# Altium schematic sheet MCU.SchDoc
size A; DocumentNumber: 2; SheetNumber: 2; SheetTotal: 6
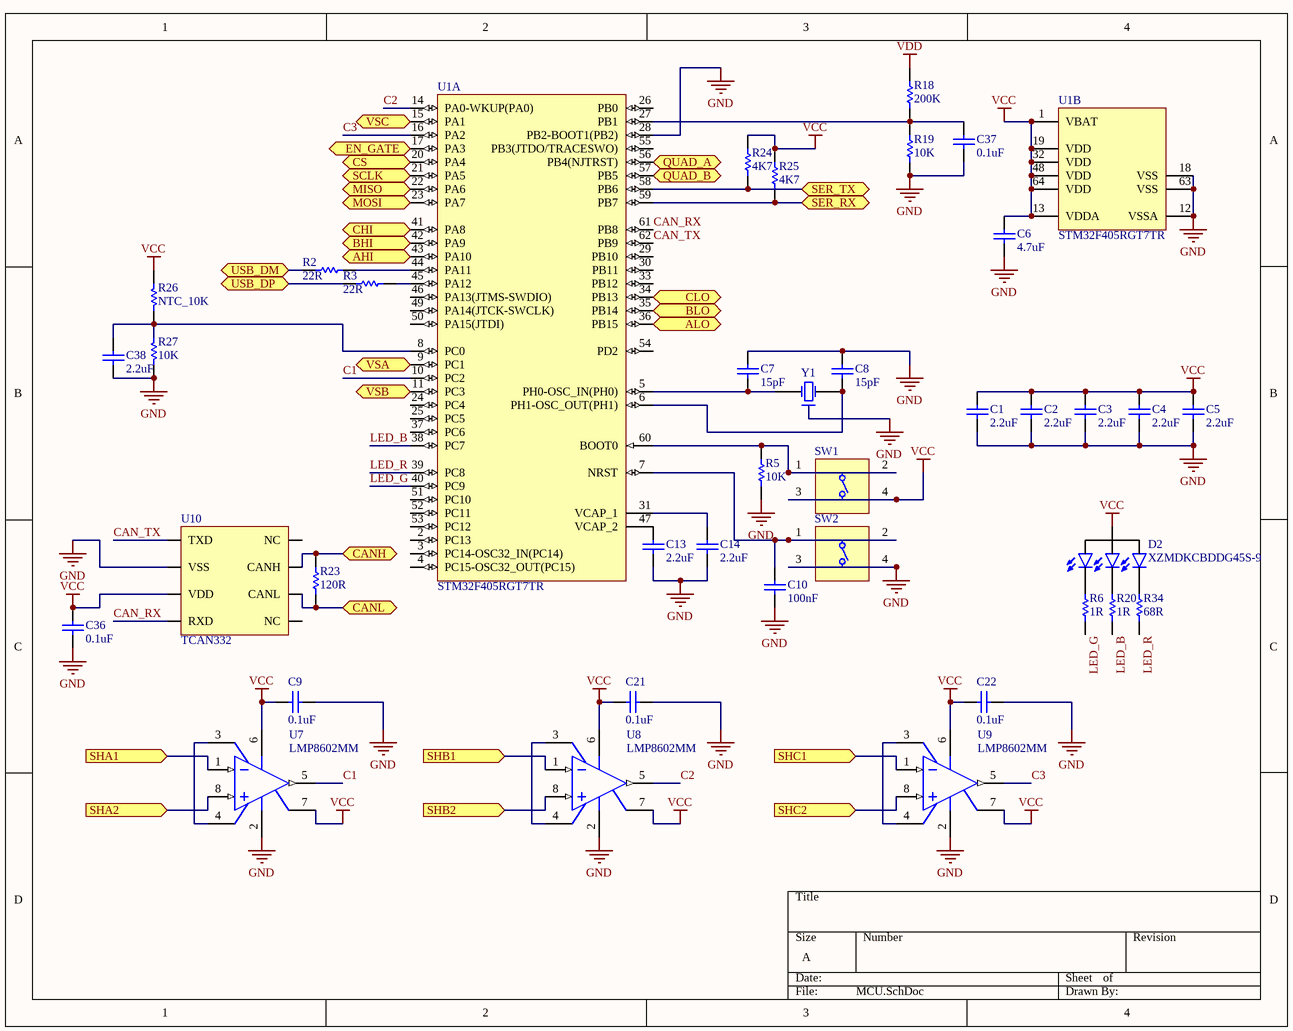
[diagram p0: MCU.SchDoc]

## Parts
C1  2.2uF  [CAPC0402(1005)60_M]
C2  2.2uF  [CAPC0402(1005)60_M]
C3  2.2uF  [CAPC0402(1005)60_M]
C4  2.2uF  [CAPC0402(1005)60_M]
C5  2.2uF  [CAPC0402(1005)60_M]
C6  4.7uF  [CAPC0402(1005)60_L]
C7  15pF  [CAPC0402(1005)60_M]
C8  15pF  [CAPC0402(1005)60_M]
C9  0.1uF  [CAPC0402(1005)60_M]
C10  100nF  [CAPC0402(1005)60_L]
C13  2.2uF  [CAPC0402(1005)60_M]
C14  2.2uF  [CAPC0402(1005)60_M]
C21  0.1uF  [CAPC0402(1005)60_M]
C22  0.1uF  [CAPC0402(1005)60_M]
C36  0.1uF  [CAPC0402(1005)60_M]
C37  0.1uF  [CAPC0402(1005)60_L]
C38  2.2uF  [CAPC0402(1005)60_M]
D2  XZMDKCBDDG45S-9  [XZMDKCBDDG45S-9]
R2  22R  [RESC0402(1005)_L]
R3  22R  [RESC0402(1005)_L]
R5  10K  [RESC0402(1005)_L]
R6  1R  [RESC0402(1005)_N]
R18  200K  [RESC0402(1005)_N]
R19  10K  [RESC0402(1005)_N]
R20  1R  [RESC0402(1005)_N]
R23  120R  [RESC0402(1005)_N]
R24  4K7  [RESC0402(1005)_L]
R25  4K7  [RESC0402(1005)_L]
R26  NTC_10K  [RESC0402(1005)_L]
R27  10K  [RESC0402(1005)_L]
R34  68R  [RESC0402(1005)_N]
SW1  (no value)  [SWITCH]
SW2  (no value)  [SWITCH]
U1  STM32F405RGT7TR  [STM-LQFP64_V]  (parts A,B of 2)
U7  LMP8602MM  [MUA08A_L]
U8  LMP8602MM  [MUA08A_L]
U9  LMP8602MM  [MUA08A_L]
U10  TCAN332  [SOT65P280X145-6N]
Y1  (no value)  [ABRA-ABM3B-4_V]

## Ports
AHI (out), ALO (out), BHI (out), BLO (out), CANH (bidir), CANL (bidir), CHI (out), CLO (out), CS (out), EN_GATE (out), MISO (in), MOSI (out), QUAD_A (in), QUAD_B (in), SCLK (out), SER_RX (bidir), SER_TX (bidir), SHA1 (in), SHA2 (in), SHB1 (in), SHB2 (in), SHC1 (in), SHC2 (in), USB_DM (bidir), USB_DP (bidir), VSA (in), VSB (in), VSC (in)

## Nets
GND: C1.1 C2.1 C3.1 C4.1 C5.1 C6.1 C7.2 C8.2 C9.2 C10.1 C13.1 C14.1 C21.2 C22.2 C36.1 C37.1 C38.1 R5.1 R19.1 R27.1 SW2.3(T3) SW2.4(T3) U1.12(VSSA) U1.18(VSS) U1.28(PB2-BOOT1(PB2)) U1.63(VSS) U7.2(GND) U8.2(GND) U9.2(GND) U10.2(VSS) Y1.2
VCC: C1.2 C2.2 C3.2 C4.2 C5.2 C6.2 C9.1 C21.1 C22.1 C36.2 D2.2(A) R24.2 R25.2 R26.2 SW1.3(T3) SW1.4(T3) U1.1(VBAT) U1.13(VDDA) U1.19(VDD) U1.32(VDD) U1.48(VDD) U1.64(VDD) U7.6(VS) U7.7(OFS) U8.6(VS) U8.7(OFS) U9.6(VS) U9.7(OFS) U10.3(VDD)
VDD: R18.1
AHI: U1.43(PA10) ; port AHI
ALO: U1.36(PB15) ; port ALO
BHI: U1.42(PA9) ; port BHI
BLO: U1.35(PB14) ; port BLO
C1: U1.10(PC2) U7.5(OUT)
C2: U1.14(PA0-WKUP(PA0)) U8.5(OUT)
C3: U1.16(PA2) U9.5(OUT)
CAN_RX: U1.61(PB8) U10.4(RXD)
CAN_TX: U1.62(PB9) U10.1(TXD)
CANH: R23.2 U10.7(CANH) ; port CANH
CANL: R23.1 U10.6(CANL) ; port CANL
CHI: U1.41(PA8) ; port CHI
CLO: U1.34(PB13) ; port CLO
CS: U1.20(PA4) ; port CS
EN_GATE: U1.17(PA3) ; port EN_GATE
LED_B: R20.1 U1.38(PC7)
LED_G: R6.1 U1.40(PC9)
LED_R: R34.1 U1.39(PC8)
MISO: U1.22(PA6) ; port MISO
MOSI: U1.23(PA7) ; port MOSI
QUAD_A: U1.56(PB4(NJTRST)) ; port QUAD_A
QUAD_B: U1.57(PB5) ; port QUAD_B
SCLK: U1.21(PA5) ; port SCLK
SER_RX: R25.1 U1.59(PB7) ; port SER_RX
SER_TX: R24.1 U1.58(PB6) ; port SER_TX
SHA1: U7.1(IN-) ; port SHA1
SHA2: U7.8(IN+) ; port SHA2
SHB1: U8.1(IN-) ; port SHB1
SHB2: U8.8(IN+) ; port SHB2
SHC1: U9.1(IN-) ; port SHC1
SHC2: U9.8(IN+) ; port SHC2
USB_DM: R2.1 ; port USB_DM
USB_DP: R3.1 ; port USB_DP
VSA: U1.9(PC1) ; port VSA
VSB: U1.11(PC3) ; port VSB
VSC: U1.15(PA1) ; port VSC
NetC7_1: C7.1 U1.5(PH0-OSC_IN(PH0)) Y1.1(X1)
NetC8_1: C8.1 U1.6(PH1-OSC_OUT(PH1)) Y1.3(X2)
NetC10_2: C10.2 SW2.1(T1) SW2.2(T2) U1.7(NRST)
NetC13_2: C13.2 U1.47(VCAP_2)
NetC14_2: C14.2 U1.31(VCAP_1)
NetC37_2: C37.2 R18.2 R19.2 U1.27(PB1)
NetC38_2: C38.2 R26.1 R27.2 U1.8(PC0)
NetD2_1: D2.1(K_Red) R34.2
NetD2_3: D2.3(K_Blue) R20.2
NetD2_4: D2.4(K_Green) R6.2
NetR2_2: R2.2 U1.44(PA11)
NetR3_2: R3.2 U1.45(PA12)
NetR5_2: R5.2 SW1.1(T1) SW1.2(T2) U1.60(BOOT0)
NetU7_3: U7.3(A1) U7.4(A2)
NetU8_3: U8.3(A1) U8.4(A2)
NetU9_3: U9.3(A1) U9.4(A2)

Not connected (* = marked no-connect by the designer): U1 2(PC13) 3(PC14-OSC32_IN(PC14)) 4(PC15-OSC32_OUT(PC15)) 24(PC4) 25(PC5) 26(PB0) 29(PB10) 30(PB11) 33(PB12) 37(PC6) 46(PA13(JTMS-SWDIO)) 49(PA14(JTCK-SWCLK)) 50(PA15(JTDI)) 51(PC10) 52(PC11) 53(PC12) 54(PD2) 55(PB3(JTDO/TRACESWO)); U10 5(NC) 8(NC)

## Library data of the parts
C1-C5 C13 C14 C38 = CMP-1034-02125-1: CAP 2.2uF 6.3V ±10% 0402 (1005 Metric) Thickness 0.6mm SMD; Case-Metric: 1005; Case-EIA: 0402; Tolerance: Â±10%; Value: 2.2uF; Technology: SMT; Rated Voltage: 6.3 V; Max Thickness: 0.6 mm
C6 = CMP-1034-02136-1: CAP 4.7uF 6.3V ±10% 0402 (1005 Metric) Thickness 0.6mm SMD; Case-EIA: 0402; Tolerance: Â±10%; Case-Metric: 1005; Technology: SMT; Value: 4.7uF; Max Thickness: 0.6 mm; Rated Voltage: 6.3 V
C7 C8 = CMP-1034-01906-1: CAP 15nF 6.3V ±10% 0402 (1005 Metric) Thickness 0.6mm SMD; Case-Metric: 1005; Case-EIA: 0402; Tolerance: Â±10%; Rated Voltage: 6.3 V; Max Thickness: 0.6 mm; Technology: SMT; Value: 15nF
C9 C10 C21 C22 C36 C37 = CMP-1034-02060-1: CAP 100nF 6.3V ±5% 0402 (1005 Metric) Thickness 0.6mm SMD; Case-EIA: 0402; Tolerance: Â±5%; Case-Metric: 1005; Rated Voltage: 6.3 V; Max Thickness: 0.6 mm; Value: 100nF; Technology: SMT
R2 R3 = CMP-1011-00034-1: 22R 0.063W 5% 0402 (1005 Metric)  SMD; Value: 22.00 Ohm; Case-EIA: 0402; Case-Metric: 1005; Power: 0.063 W; Tolerance: 5 %; Technology: SMT
R5 R19 = CMP-1011-00098-1: 10K 0.063W 5% 0402 (1005 Metric)  SMD; Case-Metric: 1005; Value: 10000.00 Ohm; Case-EIA: 0402; Technology: SMT; Tolerance: 5 %; Power: 0.063 W
R6 R20 = CMP-1011-00002-1: 1R 0.063W 5% 0402 (1005 Metric)  SMD; Case-Metric: 1005; Case-EIA: 0402; Value: 1.00 Ohm; Power: 0.063 W; Technology: SMT; Tolerance: 5 %
R18 = CMP-1011-00091-1: 5K1 0.063W 5% 0402 (1005 Metric)  SMD; Case-EIA: 0402; Value: 5100.00 Ohm; Case-Metric: 1005; Technology: SMT; Tolerance: 5 %; Power: 0.063 W
R23 = CMP-1011-00052-1: 120R 0.063W 5% 0402 (1005 Metric)  SMD; Value: 120.00 Ohm; Case-EIA: 0402; Case-Metric: 1005; Technology: SMT; Tolerance: 5 %; Power: 0.063 W
R24 R25 = CMP-1011-00090-1: 4K7 0.063W 5% 0402 (1005 Metric)  SMD; Value: 4700.00 Ohm; Case-EIA: 0402; Case-Metric: 1005; Tolerance: 5 %; Power: 0.063 W; Technology: SMT
R26 R27 = CMP-1011-00623-1: 10K 0.063W 1% 0402 (1005 Metric)  SMD; Case-Metric: 1005; Value: 10000.00 Ohm; Case-EIA: 0402; Tolerance: 1 %; Technology: SMT; Power: 0.063 W
R34 = CMP-1011-00046-1: 68R 0.063W 5% 0402 (1005 Metric)  SMD; Case-Metric: 1005; Case-EIA: 0402; Value: 68.00 Ohm; Tolerance: 5 %; Power: 0.063 W; Technology: SMT
SW1 SW2 = DIPT-DTSM-6: Switch, SPNO Push Button SMD; Manufacturer: Diptronics; PartNumber: DTSM-61NT/R; Packing Type: Tape&Reel; Mechanical Life: 200,000 cycles; ComponentLink2URL: http://www.dip.com.tw/Products_tact.htm; ComponentLink1URL: http://www.dip.com.tw/; ComponentLink3URL: http://www.dip.com.tw/PDF/pro_tact/DTSM_G_-6_2_-V.pdf; PackageDescription: Switch, Through-Hole, 4 Leads, Body 8.5x8.5mm, Row Spacing 9.0mm, Pitch 4.5mm; ComponentLink2Description: Datasheet; ComponentLink3Description: Package Specification; ComponentLink1Description: Manufacturer URL; PackageReference: DTSM-6; Mounting Technology: Through Hole
U1 = CMP-0243-00089-2: ARM Cortex-M4 32-bit MCU+FPU, 210 DMIPS, 1024 kB Flash, 192 kB Internal RAM, 51 I/Os, 64-pin LQFP, -40 to 105 degC, Tape and Reel; Manufacturer: STMicroelectronics; FLASH Size (Prog) (kB): 1024; Supply Voltage(Vcc) max (V): 3.6; Internal RAM Size (kB): 192; Supply Voltage(Vcc) min (V): 1.8; Operating Frequency(F) (Processor speed) (MHz): 168; D/A Converter: 2x12-bit; I/Os (High Current): 51; ComponentLink2Description: Datasheet; Core: ARM Cortex-M4; PackageVersion: Rev. 4, 06/2013; ComponentLink1URL: http://www.st.com/web/en/home.html; PackageReference: LQFP64; Mounting Technology: Surface Mount; ComponentLink1Description: Manufacturer URL; PackageDescription: 64-Pin Low Profile Quad Flat Package, 10 x 10 mm Body, 0.5 mm Pitch; ComponentLink3Description: Package Specification; ComponentLink2URL: http://www.st.com/st-web-ui/static/active/en/resource/technical/document/datasheet/DM00037051.pdf; PartNumber: STM32F405RGT7TR; ComponentLink3URL: http://www.st.com/st-web-ui/static/active/en/resource/technical/document/datasheet/DM00037051.pdf; Packing: Tape and Reel; DatasheetVersion: Rev. 4; PartId: 1
U7-U9 = CMP-0055-01489-1: 60V Common Mode, 50 x Gain, Bidirectional Precision Current Sensing Amplifier, 8-pin Mini SOIC, Pb-Free; Manufacturer: National Semiconductor; CompType: Amplifiers; PowerWise: N; PackageTopMarking: ZXTT*AN3A; PackageVersion: revF, Apr-2008; PackageReference: MUA08A; PackageDescription: MINI SOIC, .118 x .118 x .034in, 8 Lead, .0256in Pitch; Code_JEDEC: MO-187-AA; DatasheetVersion: Mar-2010; RoHS: Y; PinCount: 8
Y1 = ABRA-ABM3B-4